# EAGLE schematic PIC 16F877A Board_V4.2 (SMD) (EAGLE 9.6.2)
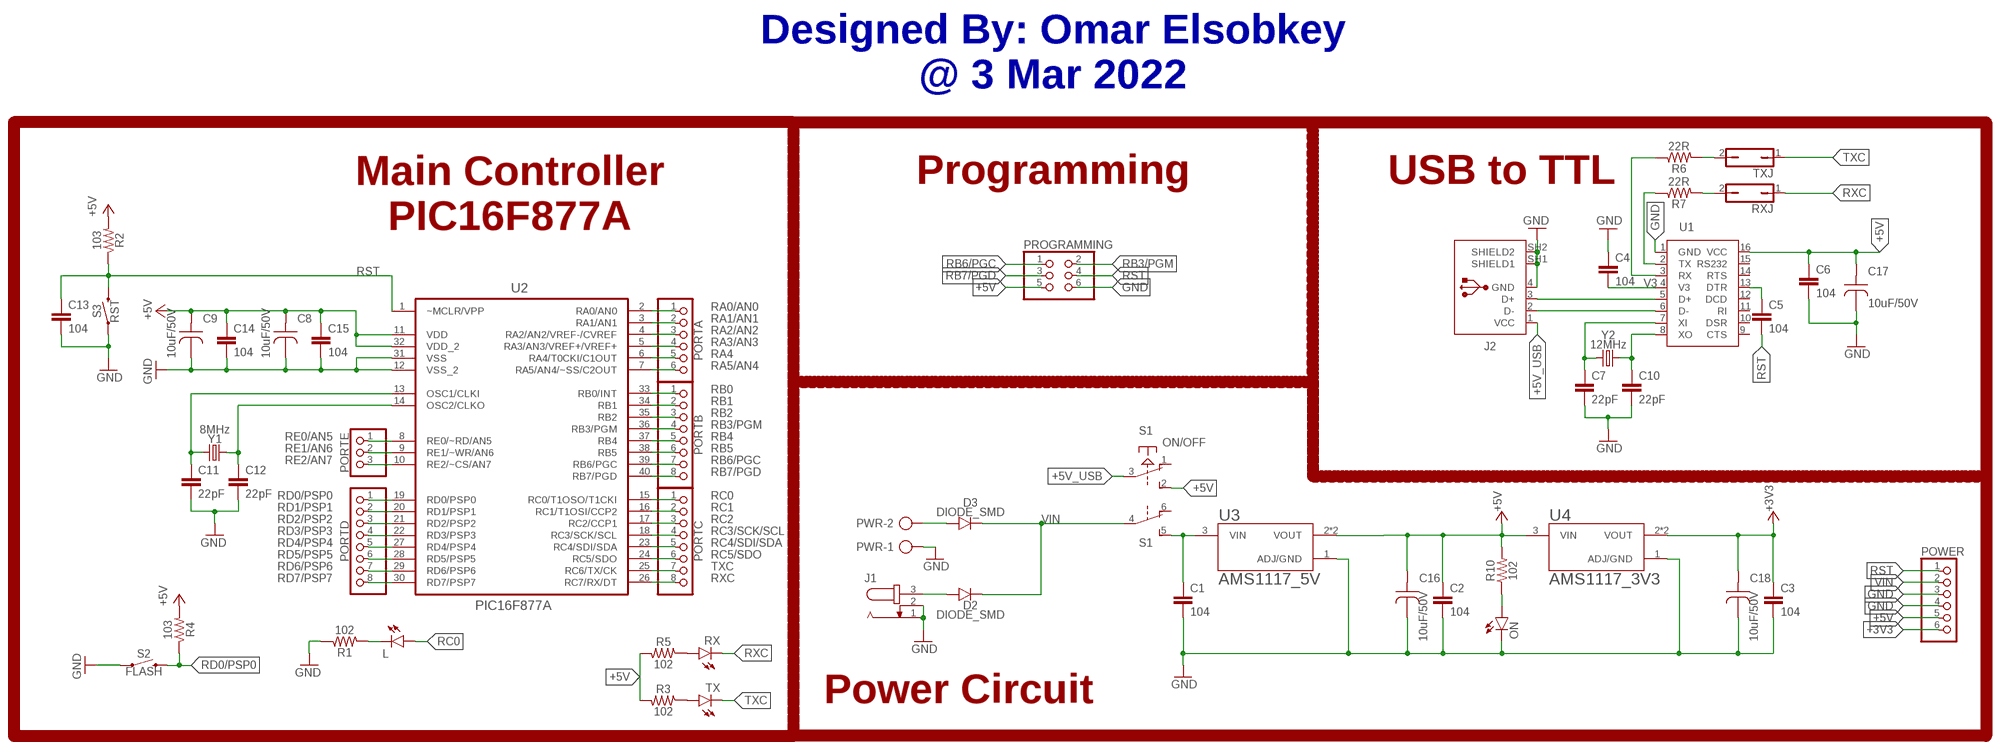
[diagram p0: schematic, sheet 1]

## Parts
C1  104  C-EUC0805K  [C0805K]
C2  104  C-EUC0805K  [C0805K]
C3  104  C-EUC0805K  [C0805K]
C4  104  C-EUC0805K  [C0805K]
C5  104  C-EUC0805K  [C0805K]
C6  104  C-EUC0805K  [C0805K]
C7  22pF  C-EUC0805K  [C0805K]
C8  10uF/50V  10UF/50V  [D5]
C9  10uF/50V  10UF/50V  [D5]
C10  22pF  C-EUC0805K  [C0805K]
C11  22pF  C-EUC0805K  [C0805K]
C12  22pF  C-EUC0805K  [C0805K]
C13  104  C-EUC0805K  [C0805K]
C14  104  C-EUC0805K  [C0805K]
C15  104  C-EUC0805K  [C0805K]
C16  10uF/50V  10UF/50V  [D5]
C17  10uF/50V  10UF/50V  [D5]
C18  10uF/50V  10UF/50V  [D5]
D2  DIODE_SMD  [SMA/DO-214AC]
D3  DIODE_SMD  [SMA/DO-214AC]
J1  JACK-PLUG0  [SPC4077]
J2  61729-1011  [61729-1011BLF]
L  LEDCHIPLED_1206  [CHIPLED_1206]
ON  LEDCHIPLED_1206  [CHIPLED_1206]
PORTA  PINHD-1X6  [1X06]
PORTB  PINHD-1X8  [1X08]
PORTC  PINHD-1X8  [1X08]
PORTD  PINHD-1X8  [1X08]
PORTE  PINHD-1X3  [1X03]
POWER  PINHD-1X6  [1X06]
PROGRAMMING  PINHD-2X3  [2X03]
PWR  2P  [2P]
R1  102  RESISTOR1206  [1206]
R2  103  RESISTOR1206  [1206]
R3  102  RESISTOR1206  [1206]
R4  103  RESISTOR1206  [1206]
R5  102  RESISTOR1206  [1206]
R6  22R  RESISTOR1206  [1206]
R7  22R  RESISTOR1206  [1206]
R10  102  RESISTOR1206  [1206]
RX  LEDCHIPLED_1206  [CHIPLED_1206]
RXJ  JP1Q  [JP1]
S1  ON/OFF  PVA2R  [PVA2R]
S2  FLASH  MOMENTARY-SWITCH-SPST-SMD-6.0X3.5MM  [TACTILE_SWITCH_SMD_6.0X3.5MM]
S3  RST  MOMENTARY-SWITCH-SPST-SMD-6.0X3.5MM  [TACTILE_SWITCH_SMD_6.0X3.5MM]
TX  LEDCHIPLED_1206  [CHIPLED_1206]
TXJ  JP1Q  [JP1]
U1  CH340G  [SOP-16]
U2  PIC16F877A  PIC16F877A-I/P  [PDIP-40]
U3  AMS1117_5V  AMS1117  [SOT223]
U4  AMS1117_3V3  AMS1117  [SOT223]
Y1  8MHz  CRYSTALPTH-HC49UV  [HC49U]
Y2  12MHz  CRYSTALPTH-HC49UV  [HC49U]

## Nets
+3V3: C3.1 C18.A POWER.6 U4.2(VOUT) U4.4(VOUT)
+5V: C2.1 C6.1 C8.A C9.A C14.1 C15.1 C16.A C17.A POWER.5 PROGRAMMING.5 R2.2 R3.2 R4.2 R5.2 R10.2 S1.2(1:S) U1.16(VCC) U2.11(VDD) U2.32(VDD_2) U3.2(VOUT) U3.4(VOUT) U4.3(VIN)
+5V_USB: J2.1(VCC) S1.3(1:P)
D+: J2.3(D+) U1.5(D+)
D-: J2.2(D-) U1.6(D-)
DTR: C5.1 U1.13(DTR)
GND [GND]: C1.2 C2.2 C3.2 C4.1 C6.2 C7.2 C8.K C9.K C10.2 C11.2 C12.2 C13.2 C14.2 C15.2 C16.K C17.K C18.K J1.1 J1.2 J2.4(GND) J2.SH1(SHIELD1) J2.SH2(SHIELD2) ON.C POWER.3 POWER.4 PROGRAMMING.6 PWR.1 R1.1 S2.1 S3.1 U1.1(GND) U2.12(VSS_2) U2.31(VSS) U3.1(ADJ/GND) U4.1(ADJ/GND)
N$1: R6.2 TXJ.2
N$2: R3.1 TX.A
N$3: R5.1 RX.A
N$5: L.C R1.2
N$7: D2.2(A) J1.3
N$8: R7.2 RXJ.2
N$13: D3.2(A) PWR.2
N$32: C1.1 S1.5(2:S) U3.3(VIN)
N$36: ON.A R10.1
OSC1: C11.1 U2.13(OSC1/CLKI) Y1.2
OSC2: C12.1 U2.14(OSC2/CLKO) Y1.1
RA0/AN0: PORTA.1 U2.2(RA0/AN0)
RA1/AN1: PORTA.2 U2.3(RA1/AN1)
RA2/AN2: PORTA.3 U2.4(RA2/AN2/VREF-/CVREF)
RA3/AN3: PORTA.4 U2.5(RA3/AN3/VREF+/VREF+)
RA4: PORTA.5 U2.6(RA4/T0CKI/C1OUT)
RA5/AN4: PORTA.6 U2.7(RA5/AN4/~SS/C2OUT)
RB0: PORTB.1 U2.33(RB0/INT)
RB1: PORTB.2 U2.34(RB1)
RB2: PORTB.3 U2.35(RB2)
RB3/PGM: PORTB.4 PROGRAMMING.2 U2.36(RB3/PGM)
RB4: PORTB.5 U2.37(RB4)
RB5: PORTB.6 U2.38(RB5)
RB6/PGC: PORTB.7 PROGRAMMING.1 U2.39(RB6/PGC)
RB7/PGD: PORTB.8 PROGRAMMING.3 U2.40(RB7/PGD)
RC0: L.A PORTC.1 U2.15(RC0/T1OSO/T1CKI)
RC1: PORTC.2 U2.16(RC1/T1OSI/CCP2)
RC2: PORTC.3 U2.17(RC2/CCP1)
RC3/SCK/SCL: PORTC.4 U2.18(RC3/SCK/SCL)
RC4/SDI/SDA: PORTC.5 U2.23(RC4/SDI/SDA)
RC5/SDO: PORTC.6 U2.24(RC5/SDO)
RD0/PSP0: PORTD.1 R4.1 S2.2 U2.19(RD0/PSP0)
RD1/PSP1: PORTD.2 U2.20(RD1/PSP1)
RD2/PSP2: PORTD.3 U2.21(RD2/PSP2)
RD3/PSP3: PORTD.4 U2.22(RD3/PSP3)
RD4/PSP4: PORTD.5 U2.27(RD4/PSP4)
RD5/PSP5: PORTD.6 U2.28(RD5/PSP5)
RD6/PSP6: PORTD.7 U2.29(RD6/PSP6)
RD7/PSP7: PORTD.8 U2.30(RD7/PSP7)
RE0/AN5: PORTE.1 U2.8(RE0/~RD/AN5)
RE1/AN6: PORTE.2 U2.9(RE1/~WR/AN6)
RE2/AN7: PORTE.3 U2.10(RE2/~CS/AN7)
RST: C5.2 C13.1 POWER.1 PROGRAMMING.4 R2.1 S3.2 U2.1(~MCLR/VPP)
RX: R6.1 U1.3(RX)
RXC: PORTC.8 RX.C RXJ.1 U2.26(RC7/RX/DT)
TX: R7.1 U1.2(TX)
TXC: PORTC.7 TX.C TXJ.1 U2.25(RC6/TX/CK)
V3: C4.2 U1.4(V3)
VIN: D2.1(C) D3.1(C) POWER.2 S1.4(2:P)
XI: C7.1 U1.7(XI) Y2.2
XO: C10.1 U1.8(XO) Y2.1
Unconnected: S1.1(1:O) S1.6(2:O) U1.9(CTS) U1.10(DSR) U1.11(RI) U1.12(DCD) U1.14(RTS) U1.15(RS232)

## Notes on the sheet
- Designed By: Omar Elsobkey
  @ 3 Mar 2022
- Programming | USB to TTL
- Main Controller
  PIC16F877A
- Power Circuit

## Library data of the parts
C1-C7 C10-C15 = rcl:C-EU: CAPACITOR, European symbol; SPICEPREFIX: C
C8 C9 C16-C18 = Capacitors:10UF/50V
D2 D3 = Diode SMD:DIODE_SMD: Rectifier Diode Switching 50V 1A 2-Pin DO-214AC T/R Rectifier Diode Switching 50V 1A 2-Pin DO-214AC T/R Check prices <https://pricing.snapeda.com/parts/S1A/NKK%20Switches/view-part?ref=eda>; AVAILABILITY: In Stock; DESCRIPTION: SMD Diodo Rectificador 1A 50V S1A SMD DO-214AC/SMA DIOTEC; MF: NKK Switches; MP: S1A; PACKAGE: DO-214 Diotec; PRICE: None
J1 = con-jack:JACK-PLUG: DC POWER JACK Power Jack, DC, Right Angle, Through Hole, Rated 5A at 16VDC, PC Terminals Distributor: Farnell (www.Farnell.de) Drawing: 84N1161.pdf / 84N1162.pdf Manufacturer: SPC Technology (www.spctechnology.com) Type: SPC4077 / SPC 4078; OC_FARNELL: unknown; OC_NEWARK: unknown
J2 = Connector_USB:61729-1011: USB(2.0) Type-B, RCPT, 4POS, THT-R/A Datasheet <https://www.amphenol-icc.com/media/wysiwyg/files/drawing/61729.pdf>; CATEGORY: Connector; CONTACTS: 4; CURRENT_RATING: 1A; DESCRIPTION: CONN RCPT USB2.0 TYPEB 4POS R/A; GENDER: Receptacle; MANUFACTURER: Amphenol ICC (FCI); MOUNT_TYPE: R/A; MPN: 61729-1011BLF; OPERATING_TEMP: -55°C to 85°C; PART_STATUS: Active; ROHS_COMPLIANT: RoHS Compliant; SERIES: 61729; SUB-CATEGORY: USB; TYPE: USB-B
L ON RX TX = led:LED: LED OSRAM: - CHIPLED LG R971, LG N971, LY N971, LG Q971, LY Q971, LO R971, LY R971 LH N974, LH R974 LS Q976, LO Q976, LY Q976 LO Q996 - Hyper CHIPLED LW Q18S LB Q993, LB Q99A, LB R99A - SideLED LS A670, LO A670, LY A670, LG A670, LP A670 LB A673, LV A673, LT A673, LW A673 LH A674 LY A675 LS A676, LA A676, LO A676, LY A676, LW A676 LS A679, LY A679, LG A679 - Hyper Micro SIDELED® LS Y876, LA Y876, LO Y876, LY Y876 LT Y87S - SmartLED LW L88C, LW L88S LB L89C, LB L89S, LG L890 LS L89K, LO L89K, LY L89K LS L896, LA L896, LO L896, LY L896 - TOPLED LS T670, LO T670, LY T670, LG T670, LP T670 LSG T670, LSP T670, LSY T670, LOP T670, LYG T670 LG T671, LOG T671, LSG T671 LB T673, LV T673, LT T673, LW T673 LH T674 LS T676, LA T676, LO T676, LY T676, LB T676, LH T676, LSB T676, LW T676 LB T67C, LV T67C, LT T67C, LS T67K, LO T67K, LY T67K, LW E67C LS E67B, LA E67B, LO E67B, LY E67B, LB E67C, LV E67C, LT E67C LW T67C LS T679, LY T679, LG T679 LS T770, LO T770, LY T770, LG T770, LP T770 LB T773, LV T773, LT T773, LW T773 LH T774 LS E675, LA E675, LY E675, LS T675 LS T776, LA T776, LO T776, LY T776, LB T776 LHGB T686 LT T68C, LB T68C - Hyper Mini TOPLED® LB M676 - Mini TOPLED Santana® LG M470 LS M47K, LO M47K, LY M47K Source: http://www.osram.convergy.de LUXEON: - LUMILED® LXK2-PW12-R00, LXK2-PW12-S00, LXK2-PW14-U00, LXK2-PW14-V00 LXK2-PM12-R00, LXK2-PM12-S00, LXK2-PM14-U00 LXK2-PE12-Q00, LXK2-PE12-R00, LXK2-PE12-S00, LXK2-PE14-T00, LXK2-PE14-U00 LXK2-PB12-K00, LXK2-PB12-L00, LXK2-PB12-M00, LXK2-PB14-N00, LXK2-PB14-P00, LXK2-PB14-Q00 LXK2-PR12-L00, LXK2-PR12-M00, LXK2-PR14-Q00, LXK2-PR14-R00 LXK2-PD12-Q00, LXK2-PD12-R00, LXK2-PD12-S00 LXK2-PH12-R00, LXK2-PH12-S00 LXK2-PL12-P00, LXK2-PL12-Q00, LXK2-PL12-R00 Source: www.luxeon.com KINGBRIGHT: KA-3528ASYC Source: www.kingbright.com
PORTA POWER = pinhead:PINHD-1X6: PIN HEADER
PORTB PORTC PORTD = pinhead:PINHD-1X8: PIN HEADER
PORTE = pinhead:PINHD-1X3: PIN HEADER
PROGRAMMING = pinhead:PINHD-2X3: PIN HEADER
PWR = Terminal Block:2P: CONNECTOR
R1-R7 R10 = SparkFun-Resistors:RESISTOR: Generic Resistor Package
RXJ TXJ = jumper:JP1Q: JUMPER
S1 = switch-misc:PVA2R: ITT SWITCH
S2 S3 = SparkFun-Switches:MOMENTARY-SWITCH-SPST: Momentary Switch (Pushbutton) - SPST Normally-open (NO) SPST momentary switches (buttons, pushbuttons). Variants PTH-12MM - 12mm square, through-hole Momentary Pushbutton Switch - 12mm Square <https://www.sparkfun.com/products/9190> (COM-09190) PTH-6.0MM, PTH-6.0MM-KIT - 6.0mm square, through-hole Mini Pushbutton Switch <https://www.sparkfun.com/products/97> (COM-00097) KIT package intended for soldering kit's - only one side of pads' copper is exposed. PTH-RIGHT-ANGLE-KIT - Right-angle, through-hole Right Angle Tactile Button <https://www.sparkfun.com/products/10791> - Used on SparkFun BigTime Watch Kit <https://www.sparkfun.com/products/11734> SMD-12MM - 12mm square, surface-mount Tactile Button - SMD (12mm) <https://www.sparkfun.com/products/12993> (COM-12993) Used on SparkFun PicoBoard <https://www.sparkfun.com/products/11888> SMD-4.5MM - 4.5mm Square Trackball Switch Used on SparkFun Blackberry Trackballer Breakout <https://www.sparkfun.com/products/13169> SMD-4.6MMX2.8MM - 4.60mm x 2.80mm, surface mount Used on SparkFun SAMD21 Mini Breakout <https://www.sparkfun.com/products/13664> SMD-5.2MM, SMD-5.2-REDUNDANT - 5.2mm square, surface-mount Mini Pushbutton Switch - SMD <https://www.sparkfun.com/products/8720> (COM-08720) Used on Arduino Pro Mini <https://www.sparkfun.com/products/11114> REDUNDANT package connects both switch circuits together SMD-6.0X3.5MM - 6.0 x 3.5mm, surface mount Momentary Reset Switch SMD <https://www.sparkfun.com/products/8229> (COM-08229) SMD-6.2MM-TALL - 6.2mm square, surface mount Tactile Button - SMD (6mm) <https://www.sparkfun.com/products/12992> Used on SparkFun Digital Sandbox <https://www.sparkfun.com/products/12651> SMD-RIGHT-ANGLE - Right-angle, surface mount Used on SparkFun Block for Intel® Edison - Arduino <https://www.sparkfun.com/products/13036>; PROD_ID: SWCH-00815; SF_SKU: COM-08229
U1 = CH340G:CH340G
U2 = PIC:PIC16F877A-I/P: 8-Bit CMOS FLASH Microcontrollers Check prices <https://pricing.snapeda.com/parts/PIC16F877A-I/P/Microchip/view-part?ref=eda>; AVAILABILITY: Good; DESCRIPTION: PIC PIC® 16F Microcontroller IC 8-Bit 20MHz 14KB (8K x 14) FLASH 44-TQFP (10x10); MF: Microchip; MP: PIC16F877A-I/P; PACKAGE: DIP-40 Microchip; PRICE: None; PURCHASE-URL: https://pricing.snapeda.com/search/part/PIC16F877A-I/P/?ref=eda
U3 U4 = v-reg:AMS1117: Sot223/Pkg 1-Amp 5-Volt Low Drop Out Voltage Regulatator
Y1 Y2 = SparkFun-Clocks:CRYSTAL: Crystals (Generic) These are passive quartz crystals, which can be used as a clock source for a microcontroller. Crystal's are two-terminal devices. They require external "load" capacitors to generate an oscillating signal.